# EAGLE design module_nRF24 (EAGLE 9.4.1)
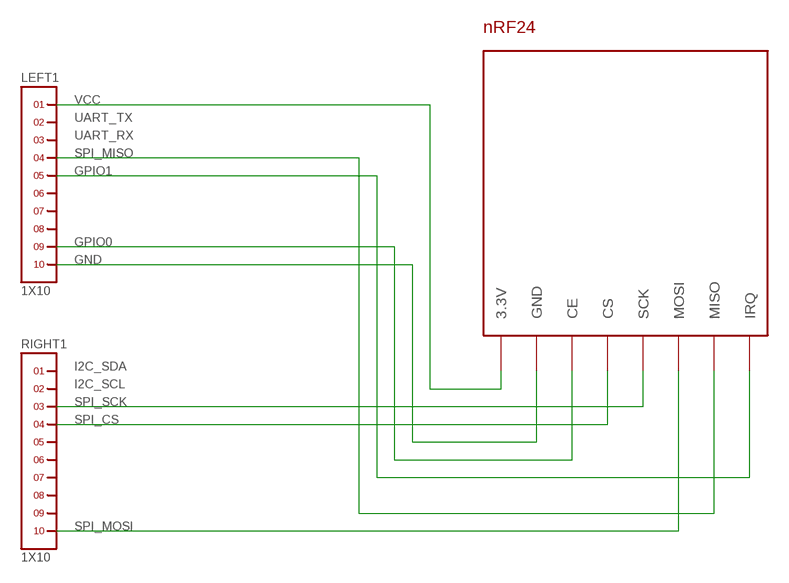
[diagram p0: schematic, sheet 1]

## Parts
LEFT1  1X10  [1X10]
RIGHT1  1X10  [1X10]
U$1  NRF24  [NRF24]

## Nets
GND: LEFT1.10 U$1.GND
INT0: LEFT1.9 U$1.CE
INT1: LEFT1.5 U$1.IRQ
SPI_CS: RIGHT1.4 U$1.CS
SPI_MISO: LEFT1.4 U$1.MISO
SPI_MOSI: RIGHT1.10 U$1.MOSI
SPI_SCK: RIGHT1.3 U$1.SCK
VCC: LEFT1.1 U$1.3.3V
Unconnected: LEFT1.2 LEFT1.3 LEFT1.6 LEFT1.7 LEFT1.8 RIGHT1.1 RIGHT1.2 RIGHT1.5 RIGHT1.6 RIGHT1.7 RIGHT1.8 RIGHT1.9

## Notes on the sheet
- VCC
- UART_TX
- UART_RX
- SPI_MISO
- GPIO1
- GPIO0
- GND
- I2C_SDA
- I2C_SCL
- SPI_SCK
- SPI_CS
- SPI_MOSI

## Library data of the parts
LEFT1 RIGHT1 = headers(2mm):1X10
U$1 = RadioShield:NRF24

## Board
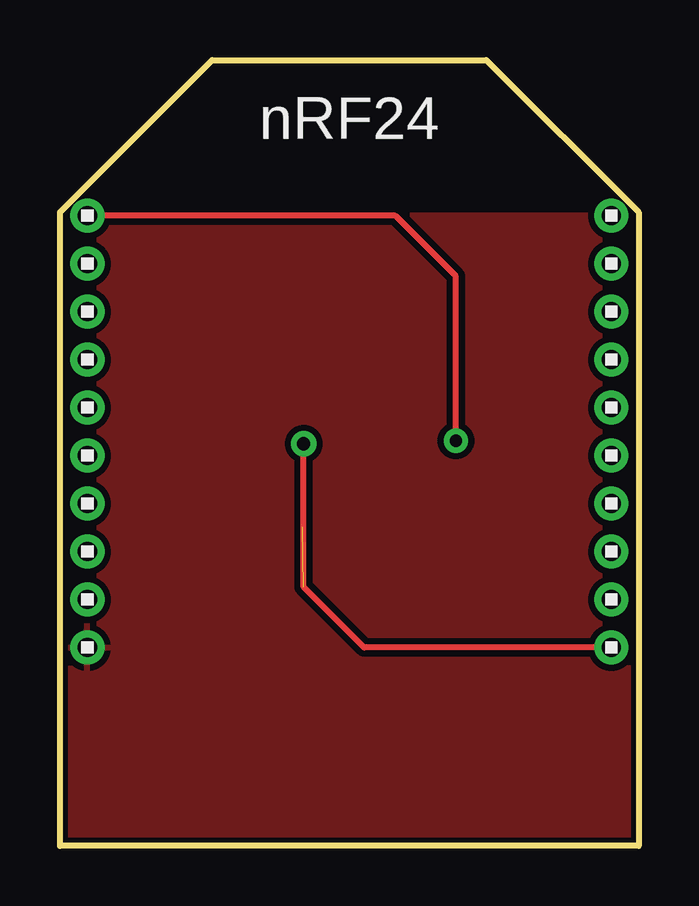
[diagram p1: board, top side]
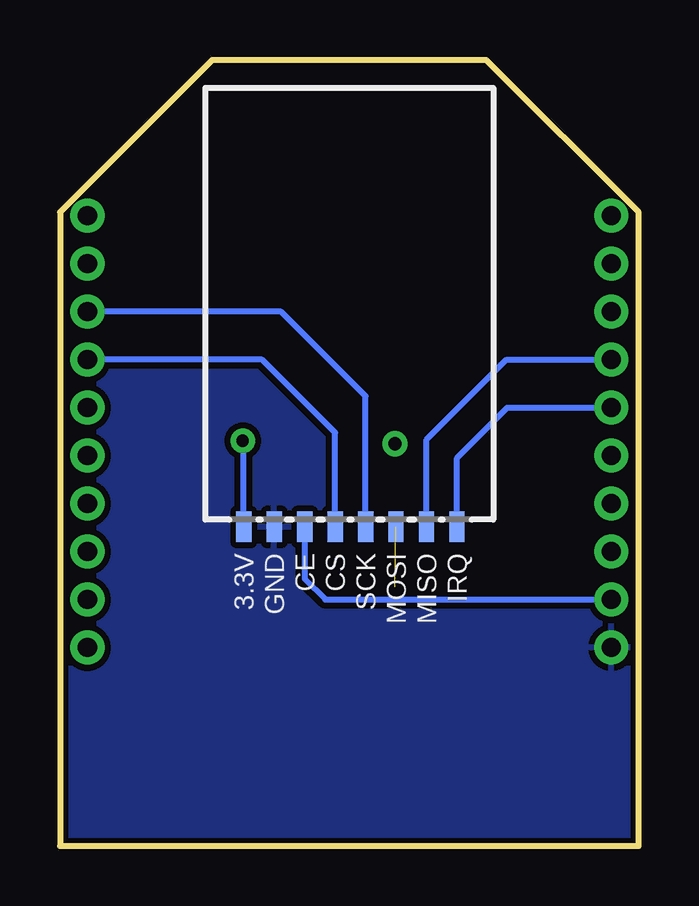
[diagram p2: board, bottom side, seen from below]

Size 24.13 x 32.77 mm. Coordinates in mm from the lower left corner, seen from the top.
Outline: 0,0 0,26.42 6.35,32.77 17.78,32.77 24.13,26.42 24.13,0 0,0
Copper layers (1*16): Top 0.035mm / dielectric 1.5mm / Bottom 0.035mm
Design rules "SparkFun-2-layer-STANDARD": minimum track width 10mil, minimum drill 20mil, track to track 10mil, track to pad 8mil, pad to pad 8mil, via to via 10mil, smd to smd 8mil, copper to edge 8mil, drill to drill 8mil, minimum pad ring 10mil, minimum via ring 10mil, stop-mask expansion 4mil, vias tented up to drill 25mil, thermal gap 10mil

### Footprints (pad centres in the part's own frame; a part is rotated, then mirrored left to right if it is on the bottom)
1X10 = drill 0.8 pad 1.422: 1 -9,0; 2 -7,0; 3 -5,0; 4 -3,0; 5 -1,0; 6 1,0; 7 3,0; 8 5,0; 9 7,0; 10 9,0
NRF24 = smd 0.635 x 1.27: 3.3V -4.4,-9.3; CE -1.86,-9.3; CS -0.59,-9.3; GND -3.13,-9.3; IRQ 4.49,-9.3; MISO 3.22,-9.3; MOSI 1.95,-9.3; SCK 0.68,-9.3

### Placement (x,y rotation side)
LEFT1  1.14,17.27 270 top
RIGHT1  22.99,17.27 270 top
U$1  12.06,22.61 0 bottom

### Tracks (layer width: path | path; a pad name or v marks a point on that pad's centre or on a via)
GND
  pour Bottom: -0.51,-0.51 -0.51,26.29 24.64,26.29 24.64,-0.51
  pour Top: -0.25,-0.25 -0.25,26.29 24.38,26.29 24.38,-0.25
INT0
  Bottom 0.254: LEFT1.9 13.07,10.27 13.92,11.13 U$1.CE
INT1
  Bottom 0.254: LEFT1.5 5.48,18.27 7.58,16.17 U$1.IRQ
SPI_CS
  Bottom 0.254: RIGHT1.4 15.7,20.27 12.65,17.23 U$1.CS
SPI_MISO
  Bottom 0.254: LEFT1.4 5.51,20.27 8.84,16.94 U$1.MISO
SPI_MOSI  (via drill 0.55)  (1 unrouted)
  Top 0.254: RIGHT1.10 12.68,8.27 10.16,10.79 v10.16,16.76
SPI_SCK
  Bottom 0.254: RIGHT1.3 14.91,22.27 11.38,18.75 U$1.SCK
VCC  (via drill 0.51)
  Top 0.254: LEFT1.1 13.99,26.27 16.51,23.75 v16.51,16.89
  Bottom 0.254: U$1.3.3V 16.46,16.85 v16.51,16.89

### Text on the board
tNames: nRF24